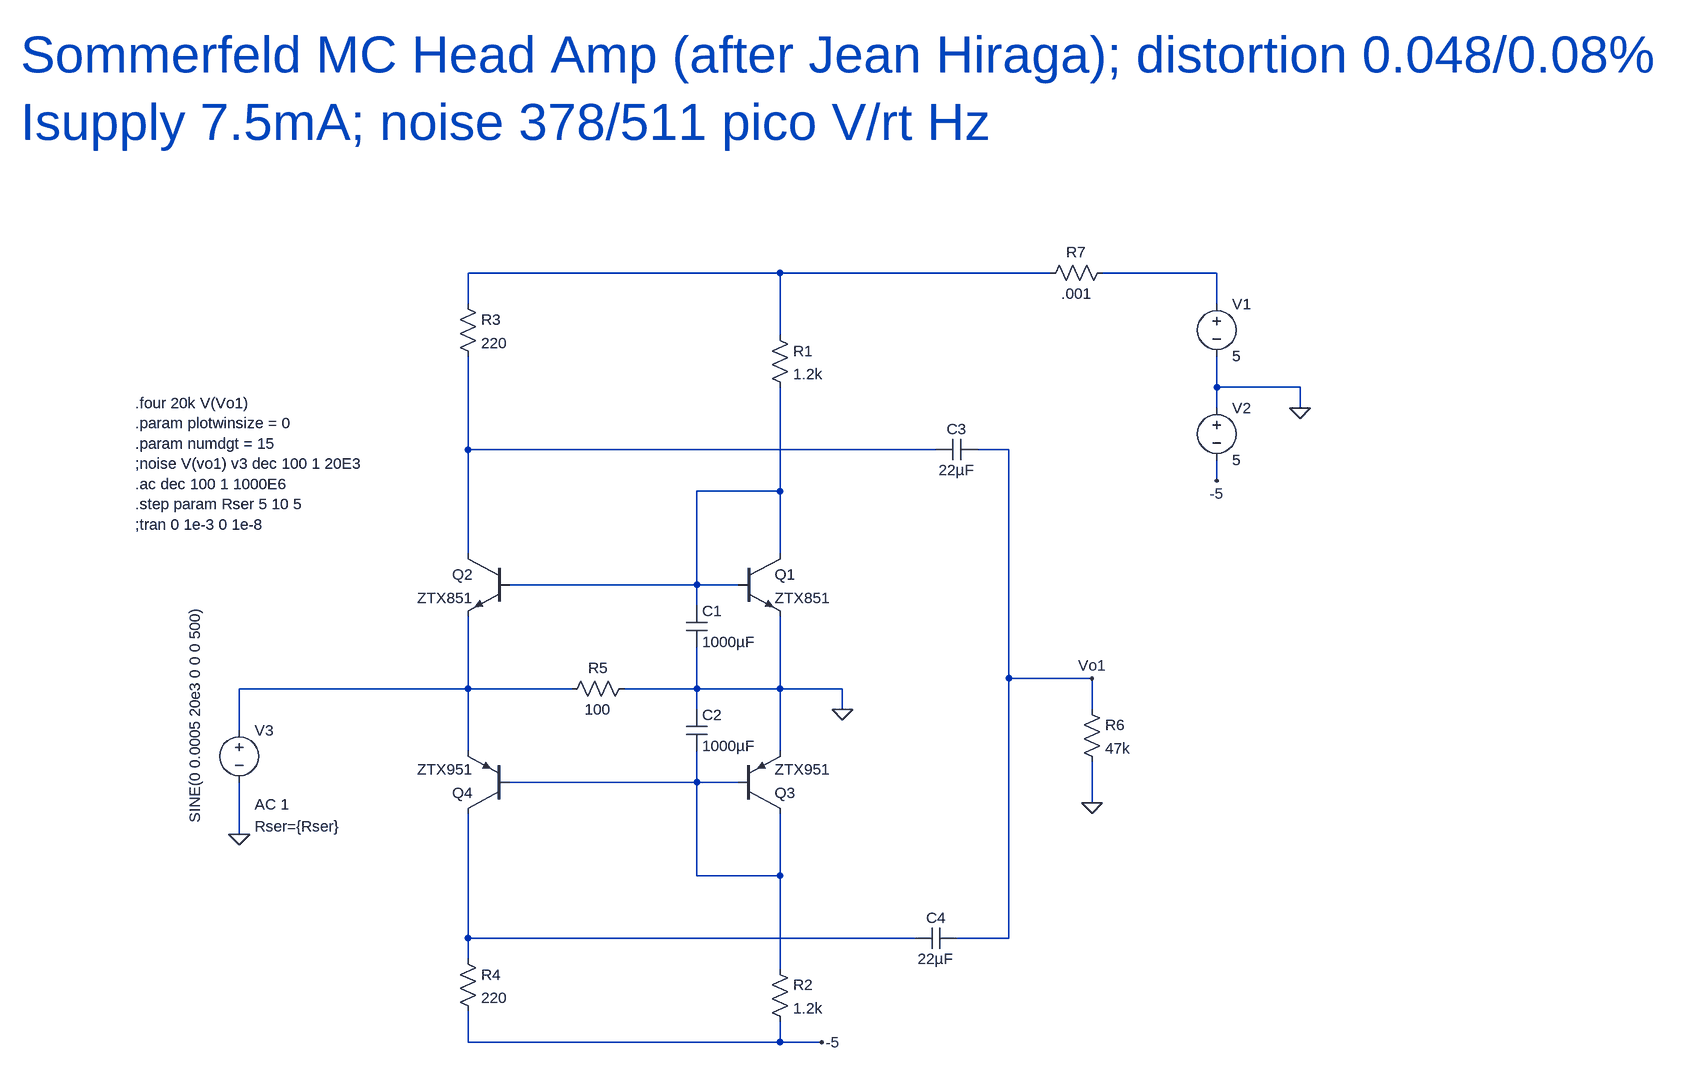
[diagram p0: schematic sommerfeld.asc]
sommerfeld.asc, the LTspice schematic file:
Version 4
SHEET 1 2384 936
WIRE 384 -320 -96 -320
WIRE 800 -320 384 -320
WIRE 1056 -320 880 -320
WIRE -96 -272 -96 -320
WIRE 1056 -272 1056 -320
WIRE 384 -224 384 -320
WIRE 1056 -144 1056 -192
WIRE 1184 -144 1056 -144
WIRE 1056 -112 1056 -144
WIRE 1184 -112 1184 -144
WIRE -96 -48 -96 -192
WIRE 624 -48 -96 -48
WIRE 736 -48 688 -48
WIRE 1056 0 1056 -32
WIRE 384 16 384 -144
WIRE 384 16 256 16
WIRE -96 112 -96 -48
WIRE 384 112 384 16
WIRE 256 160 256 16
WIRE 256 160 -32 160
WIRE 320 160 256 160
WIRE 256 192 256 160
WIRE 736 304 736 -48
WIRE 864 304 736 304
WIRE -96 320 -96 208
WIRE -96 320 -448 320
WIRE 64 320 -96 320
WIRE 256 320 256 256
WIRE 256 320 144 320
WIRE 384 320 384 208
WIRE 384 320 256 320
WIRE 480 320 384 320
WIRE 256 352 256 320
WIRE 480 352 480 320
WIRE 864 352 864 304
WIRE -448 384 -448 320
WIRE -96 416 -96 320
WIRE 384 416 384 320
WIRE 256 464 256 416
WIRE 256 464 -32 464
WIRE 320 464 256 464
WIRE 864 496 864 432
WIRE -448 544 -448 464
WIRE 256 608 256 464
WIRE 384 608 384 512
WIRE 384 608 256 608
WIRE -96 704 -96 512
WIRE 592 704 -96 704
WIRE 736 704 736 304
WIRE 736 704 656 704
WIRE -96 736 -96 704
WIRE 384 752 384 608
WIRE -96 864 -96 816
WIRE 384 864 384 832
WIRE 384 864 -96 864
WIRE 448 864 384 864
FLAG 480 352 0
FLAG 1184 -112 0
FLAG 1056 0 -5
FLAG 448 864 -5
FLAG -448 544 0
FLAG 864 496 0
FLAG 864 304 Vo1
SYMBOL npn 320 112 R0
SYMATTR InstName Q1
SYMATTR Value ZTX851
SYMBOL npn -32 112 M0
SYMATTR InstName Q2
SYMATTR Value ZTX851
SYMBOL pnp 320 512 M180
SYMATTR InstName Q3
SYMATTR Value ZTX951
SYMBOL pnp -32 512 R180
SYMATTR InstName Q4
SYMATTR Value ZTX951
SYMBOL cap 240 192 R0
SYMATTR InstName C1
SYMATTR Value 1000µF
SYMBOL cap 240 352 R0
SYMATTR InstName C2
SYMATTR Value 1000µF
SYMBOL res 368 -240 R0
SYMATTR InstName R1
SYMATTR Value 1.2k
SYMBOL res 368 736 R0
SYMATTR InstName R2
SYMATTR Value 1.2k
SYMBOL voltage 1056 -288 R0
WINDOW 123 0 0 Left 2
WINDOW 39 0 0 Left 2
SYMATTR InstName V1
SYMATTR Value 5
SYMBOL voltage 1056 -128 R0
WINDOW 123 0 0 Left 2
WINDOW 39 0 0 Left 2
SYMATTR InstName V2
SYMATTR Value 5
SYMBOL res -112 -288 R0
SYMATTR InstName R3
SYMATTR Value 220
SYMBOL res -112 720 R0
SYMATTR InstName R4
SYMATTR Value 220
SYMBOL voltage -448 368 R0
WINDOW 3 -68 -176 VRight 2
WINDOW 123 24 130 Left 2
WINDOW 39 24 164 Left 2
SYMATTR InstName V3
SYMATTR Value SINE(0 0.0005 20e3 0 0 0 500)
SYMATTR Value2 AC 1
SYMATTR SpiceLine Rser={Rser}
SYMBOL res 160 304 R90
WINDOW 0 0 56 VBottom 2
WINDOW 3 32 56 VTop 2
SYMATTR InstName R5
SYMATTR Value 100
SYMBOL cap 688 -64 R90
WINDOW 0 0 32 VBottom 2
WINDOW 3 32 32 VTop 2
SYMATTR InstName C3
SYMATTR Value 22µF
SYMBOL cap 656 688 R90
WINDOW 0 0 32 VBottom 2
WINDOW 3 32 32 VTop 2
SYMATTR InstName C4
SYMATTR Value 22µF
SYMBOL res 848 336 R0
SYMATTR InstName R6
SYMATTR Value 47k
SYMBOL res 896 -336 R90
WINDOW 0 0 56 VBottom 2
WINDOW 3 32 56 VTop 2
SYMATTR InstName R7
SYMATTR Value .001
TEXT -784 -656 Left 6 ;Sommerfeld MC Head Amp (after Jean Hiraga); distortion 0.048/0.08%\nIsupply 7.5mA; noise 378/511 pico V/rt Hz
TEXT -608 -120 Left 2 !.four 20k V(Vo1)\n.param plotwinsize = 0\n.param numdgt = 15\n;noise V(vo1) v3 dec 100 1 20E3\n.ac dec 100 1 1000E6\n.step param Rser 5 10 5\n;tran 0 1e-3 0 1e-8

The netlist it stands for:
* sommerfeld.asc
Q1 N004 N004 0 0 ZTX851
Q2 N003 N004 N005 0 ZTX851
Q3 N006 N006 0 0 ZTX951
Q4 N007 N006 N005 0 ZTX951
C1 N004 0 1000µF
C2 0 N006 1000µF
R1 N001 N004 1.2k
R2 N006 -5 1.2k
V1 N002 0 5
V2 0 -5 5
R3 N001 N003 220
R4 N007 -5 220
V3 N005 0 SINE(0 0.0005 20e3 0 0 0 500) AC 1 Rser={Rser}
R5 0 N005 100
C3 Vo1 N003 22µF
C4 Vo1 N007 22µF
R6 Vo1 0 47k
R7 N002 N001 .001
.model NPN NPN
.model PNP PNP
.lib standard.bjt
* Sommerfeld MC Head Amp (after Jean Hiraga); distortion 0.048/0.08%
* Isupply 7.5mA; noise 378/511 pico V/rt Hz
.four 20k V(Vo1)
.param plotwinsize = 0
.param numdgt = 15
;noise V(vo1) v3 dec 100 1 20E3
.ac dec 100 1 1000E6
.step param Rser 5 10 5
;tran 0 1e-3 0 1e-8
.backanno
.end